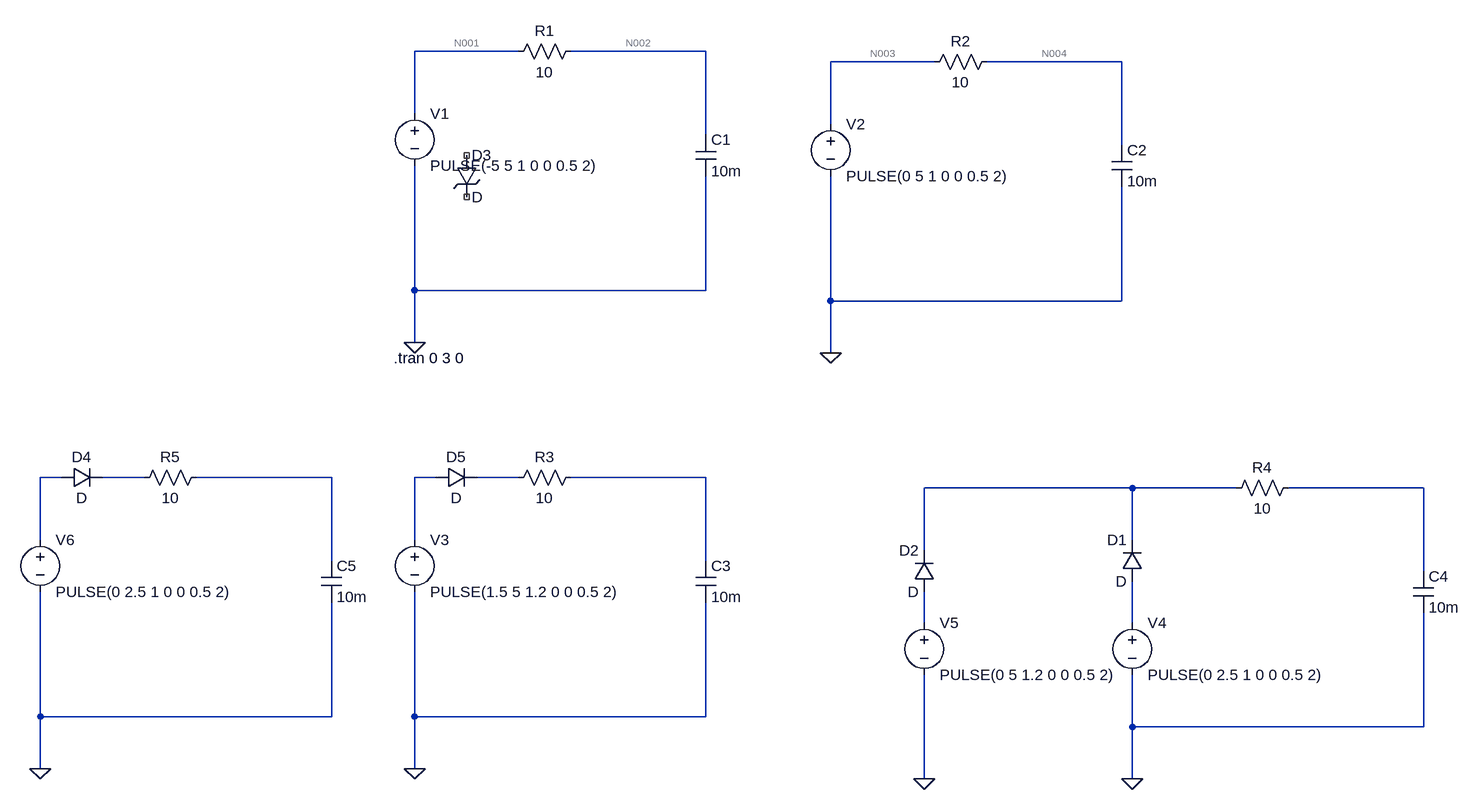
[diagram p0: schematic Test.asc]
Test.asc, the LTspice schematic file:
Version 4
SHEET 1 1568 1016
WIRE 112 -128 -48 -128
WIRE 400 -128 192 -128
WIRE 752 -112 592 -112
WIRE 1040 -112 832 -112
WIRE -48 -32 -48 -128
WIRE 592 -16 592 -112
WIRE 400 0 400 -128
WIRE 1040 16 1040 -112
WIRE -48 240 -48 48
WIRE 400 240 400 64
WIRE 400 240 -48 240
WIRE 592 256 592 64
WIRE 1040 256 1040 80
WIRE 1040 256 592 256
WIRE -48 320 -48 240
WIRE 592 336 592 256
WIRE -592 528 -624 528
WIRE -464 528 -528 528
WIRE -176 528 -384 528
WIRE -16 528 -48 528
WIRE 112 528 48 528
WIRE 400 528 192 528
WIRE 1056 544 736 544
WIRE 1216 544 1056 544
WIRE 1504 544 1296 544
WIRE -624 624 -624 528
WIRE -48 624 -48 528
WIRE 1056 624 1056 544
WIRE 736 640 736 544
WIRE -176 656 -176 528
WIRE 400 656 400 528
WIRE 1504 672 1504 544
WIRE 736 752 736 704
WIRE 1056 752 1056 688
WIRE -624 896 -624 704
WIRE -176 896 -176 720
WIRE -176 896 -624 896
WIRE -48 896 -48 704
WIRE 400 896 400 720
WIRE 400 896 -48 896
WIRE 1056 912 1056 832
WIRE 1504 912 1504 736
WIRE 1504 912 1056 912
WIRE -624 976 -624 896
WIRE -48 976 -48 896
WIRE 736 992 736 832
WIRE 1056 992 1056 912
FLAG -48 320 0
FLAG 592 336 0
FLAG -48 976 0
FLAG 1056 992 0
FLAG 736 992 0
FLAG -624 976 0
SYMBOL voltage -48 -48 R0
WINDOW 123 0 0 Left 0
WINDOW 39 0 0 Left 0
SYMATTR InstName V1
SYMATTR Value PULSE(-5 5 1 0 0 0.5 2)
SYMBOL cap 384 0 R0
SYMATTR InstName C1
SYMATTR Value 10m
SYMBOL res 208 -144 R90
WINDOW 0 0 56 VBottom 2
WINDOW 3 32 56 VTop 2
SYMATTR InstName R1
SYMATTR Value 10
SYMBOL voltage 592 -32 R0
WINDOW 123 0 0 Left 0
WINDOW 39 0 0 Left 0
SYMATTR InstName V2
SYMATTR Value PULSE(0 5 1 0 0 0.5 2)
SYMBOL cap 1024 16 R0
SYMATTR InstName C2
SYMATTR Value 10m
SYMBOL res 848 -128 R90
WINDOW 0 0 56 VBottom 2
WINDOW 3 32 56 VTop 2
SYMATTR InstName R2
SYMATTR Value 10
SYMBOL voltage -48 608 R0
WINDOW 123 0 0 Left 0
WINDOW 39 0 0 Left 0
SYMATTR InstName V3
SYMATTR Value PULSE(1.5 5 1.2 0 0 0.5 2)
SYMBOL cap 384 656 R0
SYMATTR InstName C3
SYMATTR Value 10m
SYMBOL res 208 512 R90
WINDOW 0 0 56 VBottom 2
WINDOW 3 32 56 VTop 2
SYMATTR InstName R3
SYMATTR Value 10
SYMBOL voltage 1056 736 R0
WINDOW 123 0 0 Left 0
WINDOW 39 0 0 Left 0
SYMATTR InstName V4
SYMATTR Value PULSE(0 2.5 1 0 0 0.5 2)
SYMBOL cap 1488 672 R0
SYMATTR InstName C4
SYMATTR Value 10m
SYMBOL res 1312 528 R90
WINDOW 0 0 56 VBottom 2
WINDOW 3 32 56 VTop 2
SYMATTR InstName R4
SYMATTR Value 10
SYMBOL voltage 736 736 R0
WINDOW 123 0 0 Left 0
WINDOW 39 0 0 Left 0
SYMATTR InstName V5
SYMATTR Value PULSE(0 5 1.2 0 0 0.5 2)
SYMBOL diode 1072 688 R180
WINDOW 0 24 64 Left 2
WINDOW 3 24 0 Left 2
SYMATTR InstName D1
SYMBOL diode 752 704 R180
WINDOW 0 24 64 Left 2
WINDOW 3 24 0 Left 2
SYMATTR InstName D2
SYMBOL voltage -624 608 R0
WINDOW 123 0 0 Left 0
WINDOW 39 0 0 Left 0
SYMATTR InstName V6
SYMATTR Value PULSE(0 2.5 1 0 0 0.5 2)
SYMBOL cap -192 656 R0
SYMATTR InstName C5
SYMATTR Value 10m
SYMBOL res -368 512 R90
WINDOW 0 0 56 VBottom 2
WINDOW 3 32 56 VTop 2
SYMATTR InstName R5
SYMATTR Value 10
SYMBOL TVSdiode 16 32 R0
SYMATTR InstName D3
SYMBOL diode -592 544 R270
WINDOW 0 32 32 VTop 2
WINDOW 3 0 32 VBottom 2
SYMATTR InstName D4
SYMBOL diode -16 544 R270
WINDOW 0 32 32 VTop 2
WINDOW 3 0 32 VBottom 2
SYMATTR InstName D5
TEXT -80 344 Left 2 !.tran 0 3 0

The netlist it stands for:
* Test.asc
V1 N001 0 PULSE(-5 5 1 0 0 0.5 2)
C1 N002 0 10m
R1 N002 N001 10
V2 N003 0 PULSE(0 5 1 0 0 0.5 2)
C2 N004 0 10m
R2 N004 N003 10
V3 N008 0 PULSE(1.5 5 1.2 0 0 0.5 2)
C3 N010 0 10m
R3 N010 N009 10
V4 N014 0 PULSE(0 2.5 1 0 0 0.5 2)
C4 N012 0 10m
R4 N012 N011 10
V5 N013 0 PULSE(0 5 1.2 0 0 0.5 2)
D1 N014 N011 D
D2 N013 N011 D
V6 N005 0 PULSE(0 2.5 1 0 0 0.5 2)
C5 N007 0 10m
R5 N007 N006 10
D3 NC_01 NC_02 D
D4 N005 N006 D
D5 N008 N009 D
.model D D
.lib standard.dio
.tran 0 3 0
.backanno
.end

* Results of the author's LTspice run, read from the files saved beside the schematic
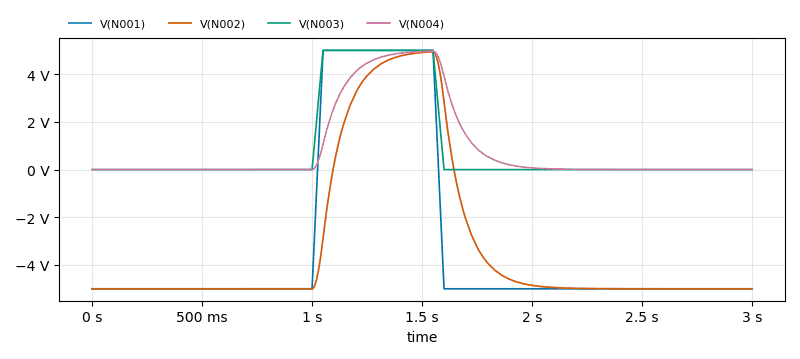
[diagram p1: Transient Analysis of Test.asc, plotted from the saved traces]
* Transient Analysis, 1 run:
*   V(N001): min -5 V, max 5 V, average -3.167 V, rms 4.945 V, last -5 V
*   V(N002): min -5 V, max 4.947 V, average -3.167 V, rms 4.65 V, last -5 V
*   V(N003): min 0 V, max 5 V, average 916.7 mV, rms 2.108 V, last 0 V
*   V(N004): min 0 V, max 4.973 V, average 916.6 mV, rms 1.933 V, last 3.255 µV